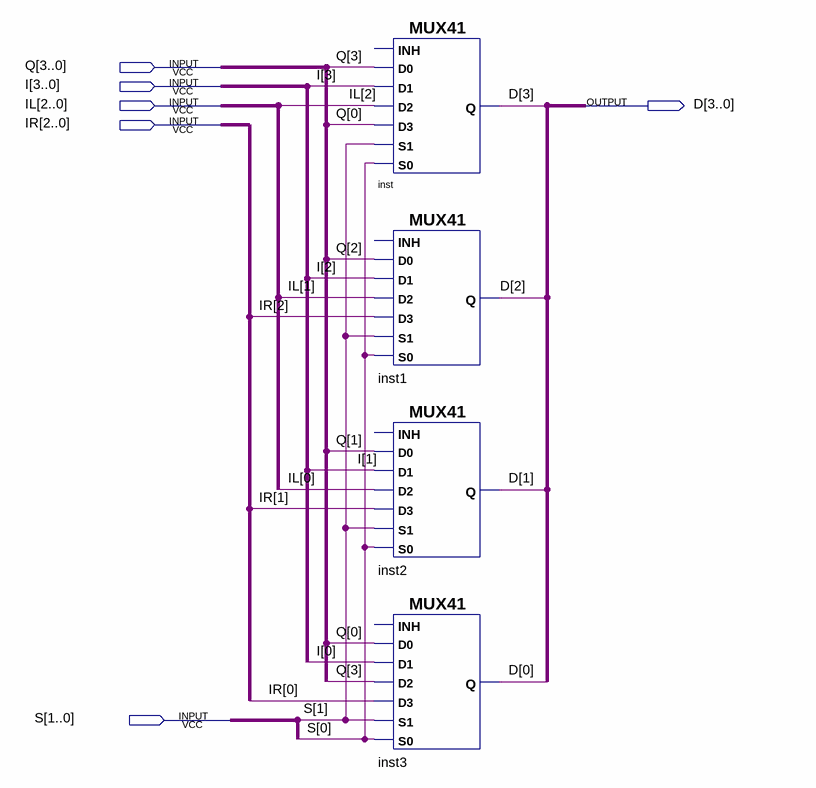
[diagram p0: schematic sheet]
// Quartus schematic CombS3.bdf as structural Verilog: 4 symbols, 6 pins
module CombS3 (
  input  [3:0] Q,
  input  [3:0] I,
  input  [2:0] IL,
  input  [2:0] IR,
  input  [1:0] S,
  output [3:0] D
);

  MUX41 inst (.S0(S[0]), .D2(IL[2]), .S1(S[1]), .D3(Q[0]), .D0(Q[3]), .D1(I[3]), .Q(D[3]));  // open: INH
  MUX41 inst1 (.S0(S[0]), .D2(IL[1]), .S1(S[1]), .D3(IR[2]), .D0(Q[2]), .D1(I[2]), .Q(D[2]));  // open: INH
  MUX41 inst2 (.S0(S[0]), .D2(IL[0]), .S1(S[1]), .D3(IR[1]), .D0(Q[1]), .D1(I[1]), .Q(D[1]));  // open: INH
  MUX41 inst3 (.S0(S[0]), .D2(Q[3]), .S1(S[1]), .D3(IR[0]), .D0(Q[0]), .D1(I[0]), .Q(D[0]));  // open: INH
endmodule
